# Altium schematic sheet A4_Receiver_Design_PCB.SchDoc
size A4; SheetNumber: 1; SheetTotal: 2
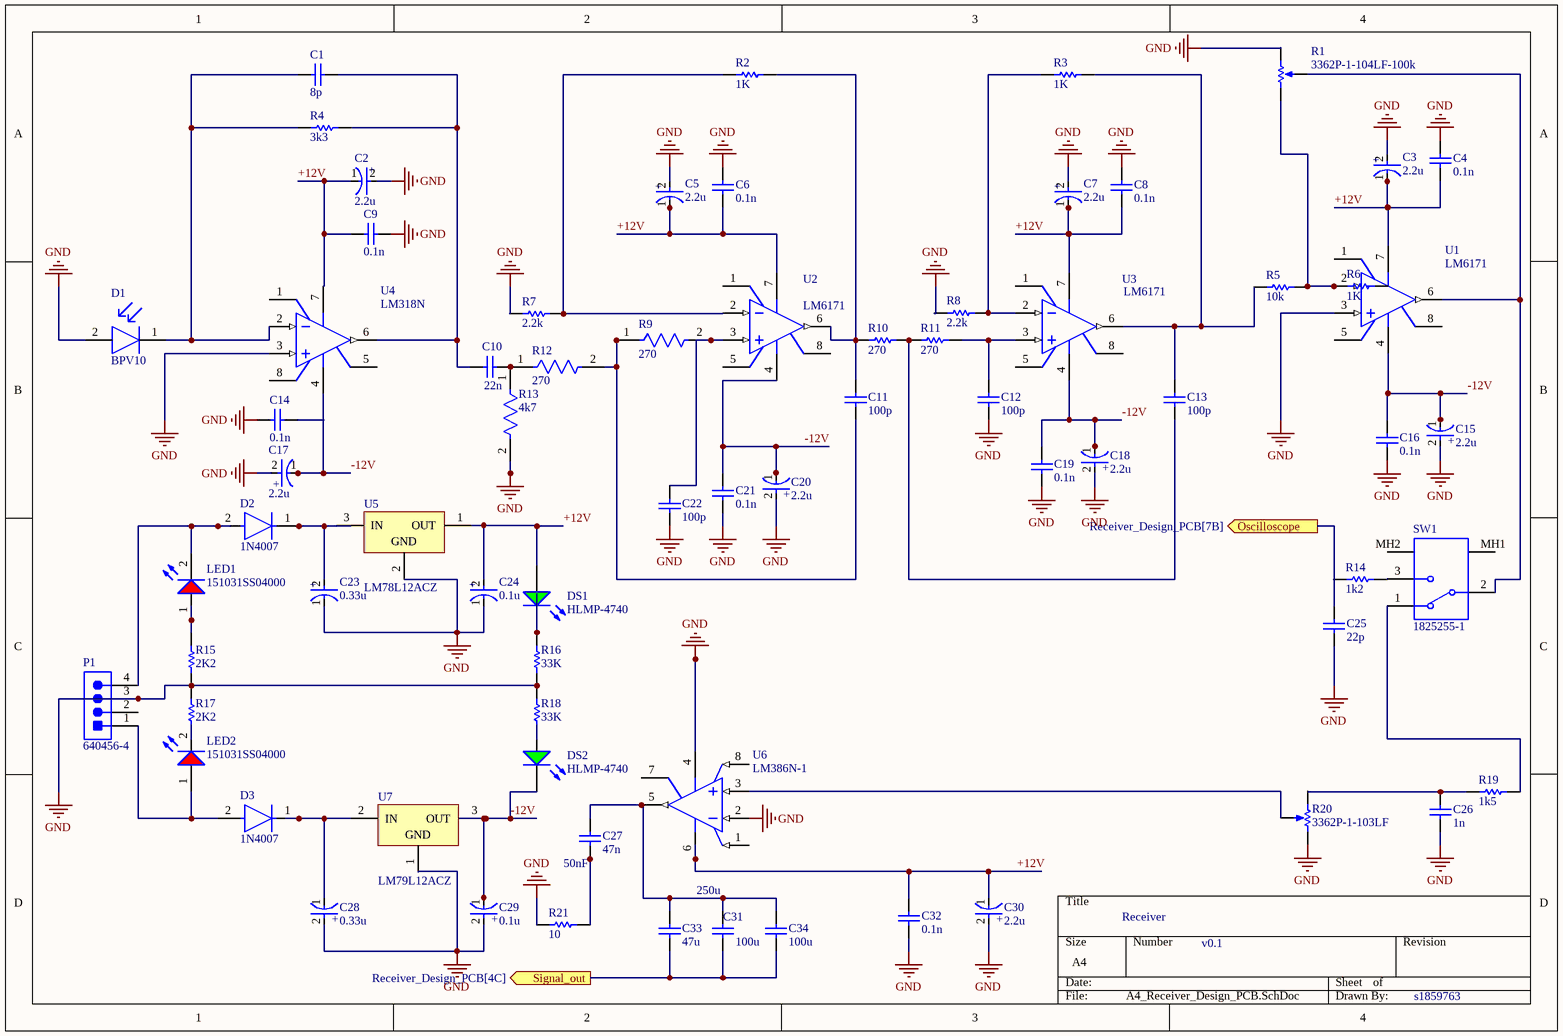
[diagram p0: A4_Receiver_Design_PCB.SchDoc]

## Parts
C1  value 8p  (hidden comment: Capacitor)
C2  2.2u  [FP-TAP106K016SCS-MFG]
C3  2.2u  [FP-TAP106K016SCS-MFG]
C4  value 0.1n  (hidden comment: Capacitor)
C5  2.2u  [FP-TAP106K016SCS-MFG]
C6  value 0.1n  (hidden comment: Capacitor)
C7  2.2u  [FP-TAP106K016SCS-MFG]
C8  value 0.1n  (hidden comment: Capacitor)
C9  value 0.1n  (hidden comment: Capacitor)
C10  value 22n  (hidden comment: Capacitor)
C11  value 100p  (hidden comment: Capacitor)
C12  value 100p  (hidden comment: Capacitor)
C13  value 100p  (hidden comment: Capacitor)
C14  value 0.1n  (hidden comment: Capacitor)
C15  2.2u  [FP-TAP106K016SCS-MFG]
C16  value 0.1n  (hidden comment: Capacitor)
C17  2.2u  [FP-TAP106K016SCS-MFG]
C18  2.2u  [FP-TAP106K016SCS-MFG]
C19  value 0.1n  (hidden comment: Capacitor)
C20  2.2u  [FP-TAP106K016SCS-MFG]
C21  value 0.1n  (hidden comment: Capacitor)
C22  value 100p  (hidden comment: Capacitor)
C23  0.33u  [FP-TAP106K016SCS-MFG]
C24  0.1u  [FP-TAP106K016SCS-MFG]
C25  value 22p  (hidden comment: Capacitor)
C26  value 1n  (hidden comment: Capacitor)
C27  value 47n  (hidden comment: Capacitor)
C28  0.33u  [FP-TAP106K016SCS-MFG]
C29  0.1u  [FP-TAP106K016SCS-MFG]
C30  2.2u  [FP-TAP106K016SCS-MFG]
C31  value 100u  (hidden comment: Capacitor)
C32  value 0.1n  (hidden comment: Capacitor)
C33  value 47u  (hidden comment: Capacitor)
C34  value 100u  (hidden comment: Capacitor)
D1  BPV10  [FP-6_544-5185_02-4-MFG]
D2  1N4007  [FP-1N4007-MFG]
D3  1N4007  [FP-1N4007-MFG]
DS1  HLMP-4740  [AVAG-HLMP-4740]
DS2  HLMP-4740  [AVAG-HLMP-4740]
LED1  151031SS04000  [WL-TMRC_D3.95H5.3]
LED2  151031SS04000  [WL-TMRC_D3.95H5.3]
P1  640456-4  [TECO-640456-4]
R1  3362P-1-104LF-100k  [BOUR-3362P]
R2  value 1K  (hidden comment: Resistor)
R3  value 1K  (hidden comment: Resistor)
R4  value 3k3  (hidden comment: Resistor)
R5  value 10k  (hidden comment: Resistor)
R6  value 1K  (hidden comment: Resistor)
R7  value 2.2k  (hidden comment: Resistor)
R8  value 2.2k  (hidden comment: Resistor)
R9  270  [FP-MRS25-MFG]
R10  value 270  (hidden comment: Resistor)
R11  value 270  (hidden comment: Resistor)
R12  270  [FP-MRS25-MFG]
R13  4k7  [FP-MRS25-MFG]
R14  value 1k2  (hidden comment: Resistor)
R15  value 2K2  (hidden comment: Resistor)
R16  value 33K  (hidden comment: Resistor)
R17  value 2K2  (hidden comment: Resistor)
R18  value 33K  (hidden comment: Resistor)
R19  value 1k5  (hidden comment: Resistor)
R20  3362P-1-103LF  [BOUR-3362P]
R21  value 10  (hidden comment: Resistor)
SW1  1825255-1  [TECO-1825255-1_V]
U1  LM6171  [D0008A_N]
U2  LM6171  [D0008A_N]
U3  LM6171  [D0008A_N]
U4  LM318N  [P0008A]
U5  LM78L12ACZ  [Z03A]
U6  LM386N-1  [TI-P8]
U7  LM79L12ACZ  [Z03A]

## Ports
Oscilloscope (out, see Receiver_Design_PCB[7B]), Signal_out (out, see Receiver_Design_PCB[4C])

## Nets
GND: C2.2(A) C3.2(A) C4.2 C5.2(A) C6.2 C7.2(A) C8.2 C9.2 C12.2 C14.2 C15.2(A) C16.2 C17.2(A) C18.2(A) C19.2 C20.2(A) C21.2 C22.2 C23.1(C) C24.1(C) C25.2 C26.2 C28.2(A) C29.2(A) C30.2(A) C32.2 D1.2(A) P1.3 R1.3(CW) R7.1 R8.1 R13.2 R15.2 R16.2 R17.1 R18.1 R20.3(CW) R21.2 U1.3(IN+) U4.3(IN+) U5.2(GND) U6.2(IN-) U6.4(GND) U7.1(GND)
+12V: C2.1(C) C3.1(C) C4.1 C5.1(C) C6.1 C7.1(C) C8.1 C9.1 C24.2(A) C30.1(C) C32.1 DS1.1(A) U1.7(V+) U2.7(V+) U3.7(V+) U4.7(V+) U5.1(OUT) U6.6(VS)
-12V: C15.1(C) C16.1 C17.1(C) C18.1(C) C19.1 C20.1(C) C21.1 C29.1(C) DS2.2(K) U1.4(V-) U2.4(V-) U3.4(V-) U4.4(V-) U7.3(OUT)
Oscilloscope: C25.1 ; port Oscilloscope
Signal_out: C31.1 C33.1 C34.1 ; port Signal_out
NetC1_1: C1.1 D1.1(C) R4.1 U4.2(IN-)
NetC1_2: C1.2 C10.1 R4.2 U4.6(OUT)
NetC10_2: C10.2 R12.1 R13.1
NetC11_1: C11.1 R2.2 R10.1 U2.6(OUT)
NetC11_2: C11.2 R9.1 R12.2
NetC12_1: C12.1 R11.2 U3.3(IN+)
NetC13_1: C13.1 R3.2 U3.6(OUT)
NetC13_2: C13.2 R10.2 R11.1
NetC22_1: C22.1 R9.2 U2.3(IN+)
NetC23_2: C23.2(A) D2.1(C)
NetC26_1: C26.1 R19.1
NetC27_1: C27.1 R21.1
NetC27_2: C27.2 C31.2 C33.2 C34.2 U6.5(VOUT)
NetC28_1: C28.1(C) D3.1(C) U7.2(IN)
NetD2_2: D2.2(A) LED1.2(K) P1.4
NetD3_2: D3.2(A) LED2.1(A) P1.1
NetDS1_2: DS1.2(K) R16.1
NetDS2_1: DS2.1(A) R18.2
NetLED1_1: LED1.1(A) R15.1
NetLED2_2: LED2.2(K) R17.2
NetR1_1: R1.1(CCW) R5.2 R6.1 U1.2(IN-)
NetR1_2: R1.2(S) SW1.2 U1.6(OUT)
NetR2_1: R2.1 R7.2 U2.2(IN-)
NetR3_1: R3.1 R8.2 U3.2(IN-)
NetR14_2: R14.2 SW1.3
NetR19_2: R19.2 SW1.1
NetR20_2: R20.2(S) U6.3(IN+)

Not connected (* = marked no-connect by the designer): C14 1; P1 2; R5 1; R6 2; R14 1; R20 1(CCW); SW1 MH1 MH2; U1 1(NC) 5(NC) 8(NC); U2 1(NC) 5(NC) 8(NC); U3 1(NC) 5(NC) 8(NC); U4 1(BAL/COMP1) 5(BAL/COMP3) 8(COMP2); U5 3(IN); U6 1(GAIN) 7(BYPASS) 8(GAIN)

## Notes on the sheet
- (near C27) 50nF
- 250u
- Receiver
- v0.1
- s1859763
- (in symbol CMP-04424-000616-1) +

## Library data of the parts
C1 C4 C6 C8-C14 C16 C19 C21 C22 C25-C27 C31-C34 = Capacitor: SimulationGenericComponent: True
C2 C3 C5 C7 C15 C17 C18 C20 C24 C29 C30 = CMP-04424-000616-1: CAP TANT 10UF 10% 16V RADIAL; Dissipation Factor: 8%; Dielectric Material: Tantalum; Leakage Current: 1.2uA; Polarity: Polar; Voltage: 35V; Life (Hours): 1000Hour; ESR (Equivalent Series Resistance): 3.2R; Lead Diameter: 0.5mm; Capacitance: 0.33u; Packaging: Bulk; Min Operating Temperature: -55°C; RoHS Compliant: Yes; Construction: RADIAL; Length: 9mm; Number of Pins: 2; Height - Seated (Max): 0.354inch; Termination: Radial; Tolerance: 10%; Case/Package: Dipped; Voltage Rating (DC): 16V; Voltage Rating: 16V; Lead Pitch: 2.5mm; Size: 9mm; Lead Free: Lead Free; Mount: Through Hole; Height: 9mm; Max Operating Temperature: 125°C; Features: General Purpose; Diameter: 5mm; Radiation Hardening: No; Package Quantity: 1000; Series: TAP
C23 C28 = CMP-04424-000616-1: CAP TANT 10UF 10% 16V RADIAL; Dissipation Factor: 8%; Dielectric Material: Tantalum; Leakage Current: 1.2uA; Polarity: Polar; Voltage: 35V; Life (Hours): 1000Hour; ESR (Equivalent Series Resistance): 3.2R; Lead Diameter: 0.5mm; Packaging: Bulk; Min Operating Temperature: -55°C; RoHS Compliant: Yes; Construction: RADIAL; Length: 9mm; Number of Pins: 2; Height - Seated (Max): 0.354inch; Termination: Radial; Tolerance: 10%; Case/Package: Dipped; Voltage Rating (DC): 16V; Voltage Rating: 16V; Lead Pitch: 2.5mm; Size: 9mm; Lead Free: Lead Free; Mount: Through Hole; Height: 9mm; Max Operating Temperature: 125°C; Features: General Purpose; Diameter: 5mm; Radiation Hardening: No; Package Quantity: 1000; Series: TAP; Capacitance: 0.33u
D1 = CMP-02531-000005-1: SENSOR PHOTODIODE 940NM RADIAL; Manufacturer: Vishay; Standoff Height: 2.6mm; Wavelength: 920nm; Response Time: 2.5ns; Power Dissipation: 215mW; Reverse Breakdown Voltage: 60V; Forward Voltage: 1V; Viewing Angle: 40°; Forward Current: 50mA; Dark Current: 0.001uA; Max Junction Temp: +100°C; Device Class L3: Photodiodes; Manufacturer Part Number: BPV10; RoHS: TRUE; Digikey Description: SENSOR PHOTODIODE 940NM RADIAL; Device Class L1: Sensors; Package: 6.544-5185.02-4; Temperature Range High: +100°C; Sensor Output: Photodiode; Temperature Range Low: -40°C; Height: 12.1mm; Lead Free: Yes; Automotive: No; ComponentLink2Description: Datasheet; Device Class L2: Optical Sensors; ComponentLink2URL: http://www.vishay.com/docs/81502/bpv10.pdf; Octopart: https://octopart.com/bpv10-vishay-39728465; Ambient Temperature Range Low: -40°C; Category: Diode; Temperature: -40°C to +100°C; Mouser Description: Photodiodes 10V 215mW 875nm; Ambient Temperature Range High: +100°C
D2 D3 = CMP-123542-000001-1: Rectifier diode 1000 V 1 A DO-41, ,; Manufacturer: Diotec; Max Surge Forward Current: 27A; Forward Current: 1A; Max Junction Temp: +175°C; Reverse Voltage: 1000V; Value: 15pF; Peak Reverse Current: 5uA; Category: Diode; Temperature Range Low: -50°C; Automotive: No; Temperature: -50°C to +175°C; Lead Free: Yes; ComponentLink2Description: Datasheet; Max Repetitive Reverse Voltage: 1000V; ComponentLink2URL: https://datasheet.octopart.com/1N4007-Diotec-datasheet-62346875.pdf; Manufacturer Part Number: 1N4007; Device Class L3: Rectifier Diodes; Height: 2.8mm; Octopart: https://octopart.com/1n4007-diotec-4040411; Package: 1N4007; Temperature Range High: +175°C; Device Class L1: Discrete Semiconductors; Device Class L2: Diodes; RoHS: TRUE; Capacitance: 15pF; Ipc Land Pattern Name: DIOAD888W100L520D280
DS1 DS2 = CMP-2000-06413-1: T-1 3/4 (5 mm) Low Current LED Lamp, Green, 1.9 V, -20 to 100 degC, 2-Pin THD, RoHS, Bulk; Manufacturer: AvagoTechnologies; Type: Uni-Color; Peak Wavelength: 565nm; Rad Hard: No; Viewing Angle: 50°; Dominant Wavelength/Color Temperature: 569nm; Number of LEDs: 1; Lens Appearance: ColoredDiffused; Lens Shape Type: Circular; Mounting Orientation: TopMount; Intensity: 2.3mcd; Datasheet Version: 07/2014; Category: LEDs; Datasheet URL: http://docs.avagotech.com/docs/AV02-1557EN; Packaging: Bulk; Pin Count: 2; Mounting Technology: ThroughHole; Package Reference: HLMP-4740; Mounting: ThroughHole; Manufacturer URL: http://www.avagotech.com/; Color: Green; Package: 2T-13/4; Package Description: 2-Pin Through Hole Device, Dia 5.845 mm, Pitch 2.54 mm
LED1 LED2 = CMP-1488-00005-2: NexarPartId: 29717802; Lens Size: 3mm; Wavelength: 635nm; Luminous Intensity: 160mcd; Peak Wavelength: 640nm; Forward Voltage: 2V; Color: Red; Max Reverse Voltage (DC): 5V; Viewing Angle: 40°; Forward Current: 100mA; Lens Style: Circular, Diffused, Round; Test Current: 20mA; Packaging: Bulk; RoHS: Compliant; Height: 5.3mm; Mount: Through Hole; Max Operating Temperature: 85°C; Length: 3mm; Dominant Wavelength: 635nm; REACH SVHC: Unknown; Case/Package: Radial; Min Operating Temperature: -40°C; Width: 3mm
P1 = CMP-2000-05419-1: Male Header, Pitch 2.54 mm, 1 x 4 Position, Height 10.03 mm, Tail Length 3.56 mm, RoHS, Bulk; Manufacturer: TE Connectivity; Material, Housing: Polyester; Primary Type: InterconnectSystem; Mount Angle: Vertical; Color, Housing: White; Current, Rating: 5 / A; Agency Approvals: CSA,UL; Contact Termination Area Plating: Tin; Temperature, Operating: -55to+105 / degC; Standards: RoHSCompliant,ELVCompliant,UL94V-0; Number of Positions: 4; Brand/Series: MTA-100Series; Angle: Straight; Pin Spacing: 0.1 / "; Material, Contact: CopperAlloy; Connector Type: MTA-100; Special Features: Pinstrip; Mounting Hole Size: 0.04 / "; Contact Centerline Spacing: 0.100 / in.; Voltage, Rating: 250 / V; Manufacturer URL: http://www.te.com/; Length, Pin: 0.14 / "; Length, Overall: 0.4 / "; Color: White; Flammability Rating: UL94V-0; Mounting Type: PCMount; Termination: Solder; Datasheet URL: https://datasheet.ciiva.com/16286/eng-ds-82056-mta-0608-16286228.pdf; Number of Contacts: 4; Contact Shape: Square; Contact Mating Area Plating: Tin; Length, Terminal Post: 0.14 / in.; Size, Post: 0.025 / in.; Contact Plating: Tin; Type: PCBPlug; Datasheet Version: Dec-14; Number of Rows: 1
R1 R20 = CMP-1747-00004-1: Square Trimpot(R) Trimming Potentiometer, 10 KOhm, 300 V, -55 to 125 degC, 3-Pin THD, RoHS, Tube; Voltage Rating: 220 mV; Power Rating: 1 W; Tolerance: 1%; Resistance: 50 mohm; Case/Package: 1206; Length: 3.2 mm; RoHSCompliant: True; PackageDescription: 3-Pin Through Hole Device, Body 6.6 x 6.99 mm, Pitch 2.54 mm; ComponentLink2Description: Datasheet; REACH SVHC: No SVHC; Mount: Surface Mount; Height: 0.6 mm; Packaging: Tape and Reel; ComponentLink1URL: http://www.bourns.com/; Case Code (Imperial): 0612; Pins: 2; Case Code (Metric): 1632; ComponentLink2URL: http://www.bourns.com/docs/Product-Datasheets/3362.pdf; Min Operating Temperature: -25degC; ComponentLink1Description: Manufacturer URL; PackageReference: 3326P; Max Operating Temperature: 125degC; Width: 1.6 mm; Package Quantity: 5000; DatasheetVersion: May-16
R2-R8 R10 R11 R14-R19 R21 = Resistor: TC1: 0; SimulationGenericComponent: True; TC2: 0
R9 R12 R13 = CMP-02408-000051-1: RES 1K OHM 0.6W 1% AXIAL; Power Rating: 600mW; Lead Diameter: 0.6mm; Voltage Rating (DC): 350V; Resistance: 1kR; Temperature Coefficient: 50ppm/°C; Width: 2.5mm; Military Standard: Not; Package Quantity: 5000; Radiation Hardening: No; Case/Package: Axial; Resistance Tolerance: 1%; Resistor Type: Metal Film; Contact Plating: Tin; Length: 6.5mm; Lead Free: Lead Free; RoHS Compliant: Yes; Mount: Through Hole; Number of Pins: 2; Technology: THIN FILM; Voltage Rating: 350V; Min Operating Temperature: -55°C; Weight: 0.00776oz; Diameter: 2.5mm; Construction: Cylindrical; Series: MRS25; Tolerance: 1%; Packaging: Tape and Reel; Max Operating Temperature: 155°C; Max Power Dissipation: 600mW; Number of Terminations: 2; Termination: Axial
SW1 = CMP-2100-03576-1: Slide Switch, SPDT, 125 V, -20 to 85 degC, 5-Pin THD, RoHS, Tray; Manufacturer: TE Connectivity; Electrical Life: 15000Cycles; Number of Positions: 2; Operating Force: 600gf; Max Voltage Rating (AC): 125V; Actuator Length: 4.5mm; Current Rating: 300mA; Contact Style: Shorting; Switch Travel: 4mm; Flammability Rating: UL94HB; Termination: PCPins; Package Quantity: 560; Throw Configuration: SPDT; Datasheet Version: Rev. A4, 03/2014; Mount: ThroughHole; Package Reference: 1825255-1; Case/Package: 300; Depth: 6.7mm; Packaging: Bulk; Package Description: 5-Pin Through Hole Device, Body 6.7 x 16 mm, Pitch 4 mm; REACH SVHC: Unknown; ELV: Compliant; Voltage Rating (AC): 125V; Max Current Rating: 300mA; Radiation Hardening: No; Min Operating Temperature: -20degC; Contact Plating: Silver; Length: 16mm; Manufacturer URL: http://www.te.com/; Orientation: Vertical; Contact Material: Copper; RoHSCompliant: true; Lead Free: LeadFree; Max Operating Temperature: 85degC; Datasheet URL: http://www.te.com/commerce/DocumentDelivery/DDEController?Action=showdoc&DocId=Customer+Drawing%7F1825255%7FA4%7Fpdf%7FEnglish%7FENG_CD_1825255_A4_baseFilename.pdf%7F1825255-1
U1-U3 = CMP-0055-00797-3: High Speed Low Power Low Distortion Voltage Feedback Amplifier, 8-pin Narrow SOIC, Pb-Free; Manufacturer: Texas Instruments; PowerWise: Y; PackageTopMarking: NSZXTT*LM61*71AIM; CompType: Amplifiers; ComponentLink1URL: http://www.ti.com/general/docs/lit/getliterature.tsp?genericPartNumber=LM6171&fileType=pdf; Package Reference: D0008A; PackageDescription: SOIC Narrow, 4.9 x 3.9 x 1.45mm, 8 Lead, 1.27mm Pitch; Code_JEDEC: MS-012-AA; RoHS: Y; ComponentLink1Description: Datasheet URL; Code_IPC: SOIC127P600-8; PinCount: 8
U4 = CMP-0055-00106-3: Operational Amplifier, 8-pin MDIP; Manufacturer: Texas Instruments; CompType: Amplifiers; PackageTopMarking: NSUZXYTTE#*LM*318N; PowerWise: N; RoHS: N; ComponentLink1Description: Datasheet URL; Package Reference: P0008A; ComponentLink1URL: http://www.ti.com/general/docs/lit/getliterature.tsp?genericPartNumber=LM318-N&fileType=pdf; PackageDescription: MDIP, .365 x .250 x .130in, 8 Lead, .100in Pitch; PinCount: 8; Code_JEDEC: MS-001-BA
U5 = CMP-0062-00054-2: 3-Terminal Positive Regulators, 3-pin TO-92; Manufacturer: National Semiconductor; CompType: LDO IC; PackageTopMarking: NSXYTT*LM78L*12ACZ; PowerWise: N; ComponentLink1URL: http://www.national.com/ds/LM/LM78L12.pdf; RevisionNote: Component URLs added; Code_JEDEC: TO-226-AA; ComponentLink3Description: Z03A Package Page; ComponentLink2URL: http://www.national.com/pf/LM/LM78L12.html; PackageDescription: TO-92, Molded, 3 Lead; ComponentLink3URL: http://www.national.com/packaging/folders/z03a.html; RoHS: N; ComponentLink2Description: LM78L12 Web Page; DatasheetVersion: Apr-2006; PackageVersion: revG, Sep-2000; PinCount: 3; ComponentLink1Description: LM78L12 Datasheet; PackageReference: Z03A
U6 = CMP-0057-00051-3: Low Voltage Audio Power Amplifier, 0 to 70 degC, 8-pin DIP (P8); Manufacturer: Texas Instruments; Input Type: Analog; SubFamily: Mid/High-Power Amplifier; Max. Number of Speaker Outputs: 1; PartNumber: LM386N-1; ComponentLink2Description: Datasheet; Mounting Technology: Through Hole; Code_JEDEC: MS-001; PackageReference: P8; ComponentLink3Description: Package Specification; ComponentLink3URL: http://www.ti.com/litv/pdf/mpdi001b; PackageDescription: 8-Pin Plastic In-Line, Body 9.59 x 6.35 mm, Pitch 2.54 mm; ComponentLink1Description: Manufacturer URL; ComponentLink1URL: http://www.ti.com/; PackageVersion: 4040082/E, 04/2010; ComponentLink2URL: http://www.ti.com/general/docs/lit/getliterature.tsp?genericPartNumber=LM386&fileType=pdf; DatasheetVersion: SNAS545A
U7 = CMP-0062-00062-2: Series 3-Terminal Negative Regulators, 3-pin TO-92; Manufacturer: National Semiconductor; PowerWise: N; CompType: LDO IC; PackageTopMarking: NSXYTT*320L*79L12; RevisionNote: Component URLs added; PackageReference: Z03A; PinCount: 3; Code_JEDEC: TO-226-AA; ComponentLink3Description: Z03A Package Page; PackageVersion: revG, Sep-2000; ComponentLink1Description: LM79L12AC Datasheet; ComponentLink1URL: http://www.national.com/ds/LM/LM79L12.pdf; PackageDescription: TO-92, Molded, 3 Lead; DatasheetVersion: Mar-2006; RoHS: N; ComponentLink3URL: http://www.national.com/packaging/folders/z03a.html; ComponentLink2URL: http://www.national.com/pf/LM/LM79L12AC.html; ComponentLink2Description: LM79L12AC Web Page